# Altium schematic sheet MAIN.schdoc
size 299 x 217 mm
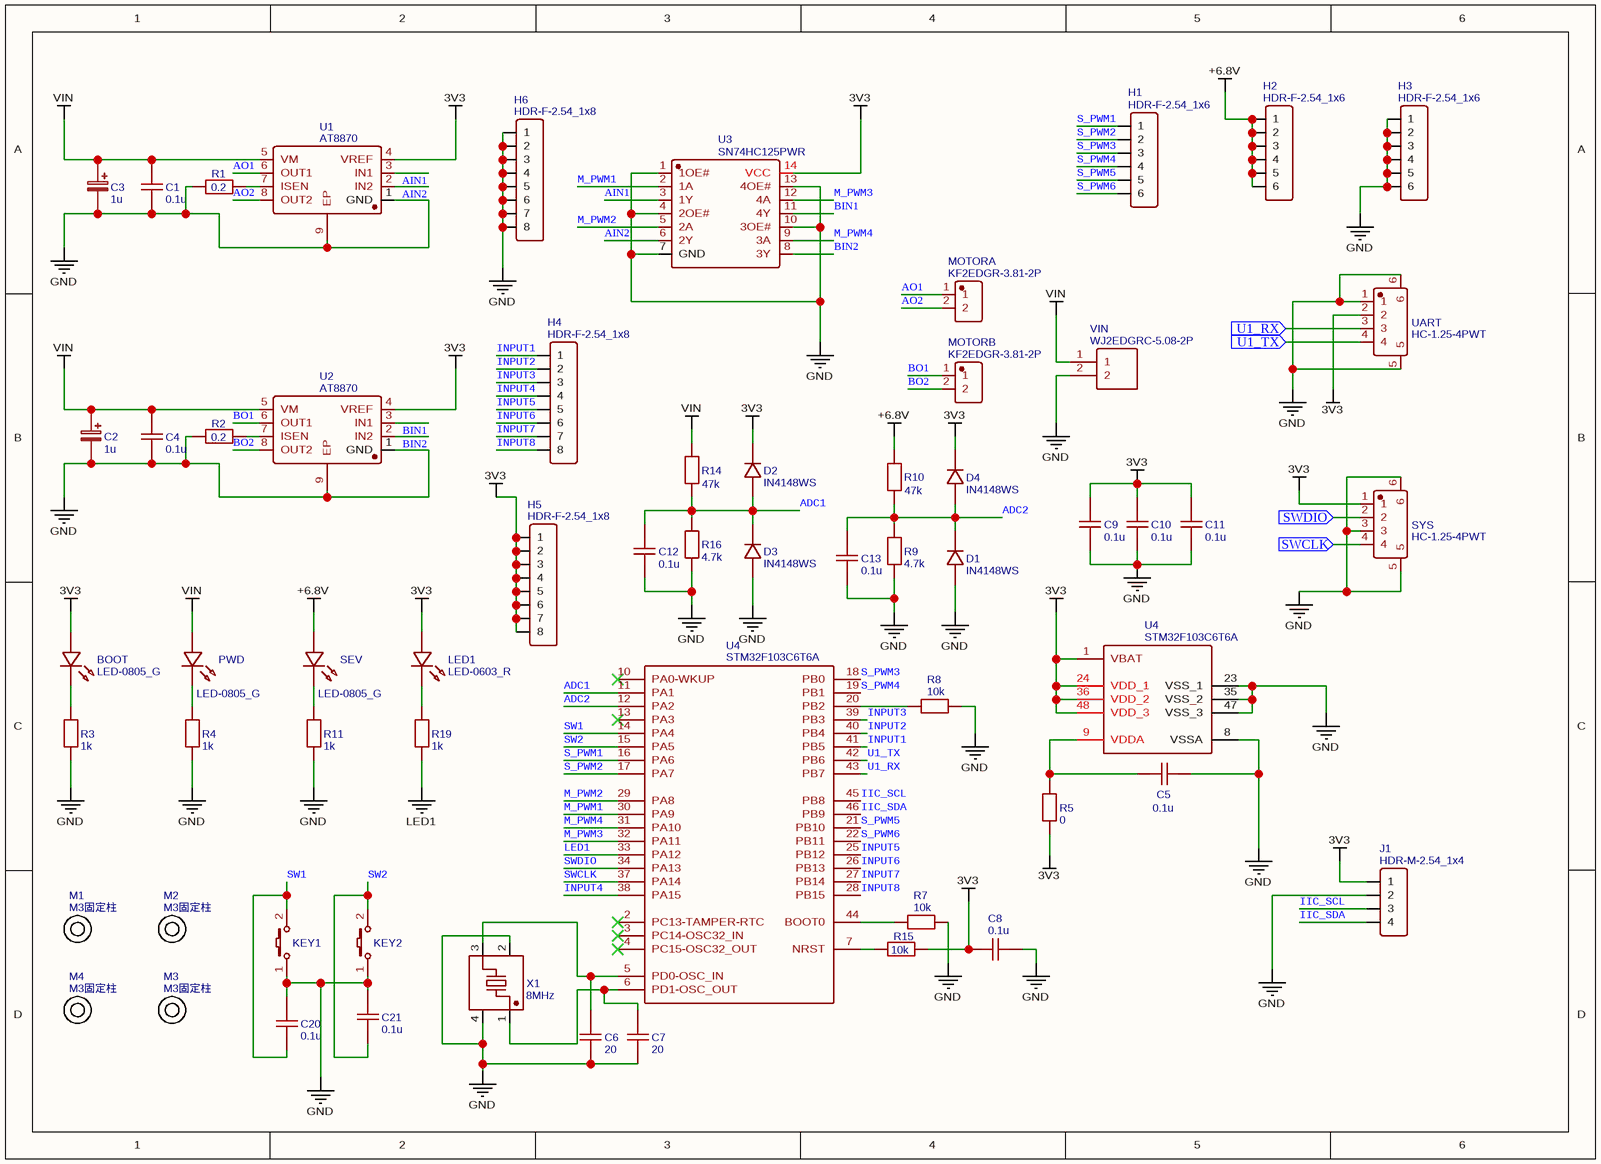
[diagram p0: MAIN.schdoc]

## Parts
(Parts that share a designator on the sheet are numbered #1, #2 ... from top to bottom, then left to right.)
BOOT  LED-0805_G  [LED0805_GREEN]
C1  0.1u  [C0603]
C2  1u  [CAP-D6.3×H5.5]
C3  1u  [CAP-D6.3×H5.5]
C4  0.1u  [C0603]
C5  0.1u  [C0603]
C6  20  [C0603]
C7  20  [C0603]
C8  0.1u  [C0603]
C9  0.1u  [C0603]
C10  0.1u  [C0603]
C11  0.1u  [C0603]
C12  0.1u  [C0603]
C13  0.1u  [C0603]
C20  0.1u  [C0603]
C21  0.1u  [C0603]
D1  IN4148WS  [SOD-323_L1.8-W1.3-LS2.5-RD]
D2  IN4148WS  [SOD-323_L1.8-W1.3-LS2.5-RD]
D3  IN4148WS  [SOD-323_L1.8-W1.3-LS2.5-RD]
D4  IN4148WS  [SOD-323_L1.8-W1.3-LS2.5-RD]
H1  HDR-F-2.54_1x6  [HDR-F-2.54_1X6]
H2  HDR-F-2.54_1x6  [HDR-F-2.54_1X6]
H3  HDR-F-2.54_1x6  [HDR-F-2.54_1X6]
H4  HDR-F-2.54_1x8  [HDR-F-2.54_1X8]
H5  HDR-F-2.54_1x8  [HDR-F-2.54_1X8]
H6  HDR-F-2.54_1x8  [HDR-F-2.54_1X8]
J1  HDR-M-2.54_1x4  [HDR-M-2.54_1X4]
KEY1  K2-3.6×6.1_SMD  [KEY-SMD_2P-L6.2-W3.6-LS8.0]  (value not drawn)
KEY2  K2-3.6×6.1_SMD  [KEY-SMD_2P-L6.2-W3.6-LS8.0]  (value not drawn)
LED1  LED-0603_R  [LED0603_RED]
M1  M3固定柱  [M3螺丝孔外直径6MM-带8小孔]
M2  M3固定柱  [M3螺丝孔外直径6MM-带8小孔]
M3  M3固定柱  [M3螺丝孔外直径6MM-带8小孔]
M4  M3固定柱  [M3螺丝孔外直径6MM-带8小孔]
MOTORA  KF2EDGR-3.81-2P  [CONN-TH_2P-P3.81_KF2EDGR-3.81-2P]
MOTORB  KF2EDGR-3.81-2P  [CONN-TH_2P-P3.81_KF2EDGR-3.81-2P]
PWD  LED-0805_G  [LED0805_GREEN]
R1  0.2  [R0603]
R2  0.2  [R0603]
R3  1k  [R0603]
R4  1k  [R0603]
R5  0  [R0603]
R7  10k  [R0603]
R8  10k  [R0603]
R9  4.7k  [R0603]
R10  47k  [R0603]
R11  1k  [R0603]
R14  47k  [R0603]
R15  10k  [R0603]
R16  4.7k  [R0603]
R19  1k  [R0603]
SEV  LED-0805_G  [LED0805_GREEN]
SYS  HC-1.25-4PWT  [CONN-SMD_4P-P1.25-HC-1.25-4PWT]
U1  AT8870  [SOP-8_L4.9-W3.9-P1.27-LS6.0-BL-EP]
U2  AT8870  [SOP-8_L4.9-W3.9-P1.27-LS6.0-BL-EP]
U3  SN74HC125PWR  [TSSOP-14_L5.0-W4.4-P0.65-LS6.5-BL]
U4#1  STM32F103C6T6A  [LQFP-48_L7.0-W7.0-P0.50-LS9.0-BL]
U4#2  STM32F103C6T6A  [LQFP-48_L7.0-W7.0-P0.50-LS9.0-BL]
UART  HC-1.25-4PWT  [CONN-SMD_4P-P1.25-HC-1.25-4PWT]
VIN  WJ2EDGRC-5.08-2P  [CONN-TH_2P-P5.08_WJ2EDGRC-5.08-2P]
X1  8MHz  [CRYSTAL-SMD_4P-L3.2-W2.5-BL]

## Ports
SWCLK (in), SWDIO (in), U1_RX (in), U1_TX (in)

## Nets
3V3: BOOT.1 C8.1 C9.2 C10.2 C11.2 D2.1(C) D4.1(C) H5.1 H5.2 H5.3 H5.4 H5.5 H5.6 H5.7 H5.8 J1.1 LED1.1 R5.1 R15.2 SYS.1 U1.4(VREF) U2.4(VREF) U3.14(VCC) U4#1.1(VBAT) U4#1.24(VDD_1) U4#1.36(VDD_2) U4#1.48(VDD_3) UART.2
+6.8V: H2.1 H2.2 H2.3 H2.4 H2.5 H2.6 R10.2 SEV.1
GND: C1.1 C2.2 C3.2 C4.1 C5.2 C6.1 C7.1 C8.2 C9.1 C10.1 C11.1 C12.1 C13.1 C20.2 C21.2 D1.2(A) D3.2(A) H3.1 H3.2 H3.3 H3.4 H3.5 H3.6 H6.1 H6.2 H6.3 H6.4 H6.5 H6.6 H6.7 H6.8 J1.2 KEY1.1 KEY2.1 R1.2 R2.2 R3.1 R4.1 R7.2 R8.2 R9.1 R11.1 R16.1 SYS.3 SYS.5 SYS.6 U1.1(GND) U1.9(EP) U2.1(GND) U2.9(EP) U3.1(1OE#) U3.4(2OE#) U3.7(GND) U3.10(3OE#) U3.13(4OE#) U4#1.8(VSSA) U4#1.23(VSS_1) U4#1.35(VSS_2) U4#1.47(VSS_3) UART.1 UART.5 UART.6 VIN.2 X1.2(GND) X1.4(GND)
LED1: R19.1 U4#2.33(PA12)
VIN: C1.2 C2.1 C3.1 C4.2 PWD.1 R14.2 U1.5(VM) U2.5(VM) VIN.1
ADC1: C12.2 D2.2(A) D3.1(C) R14.1 R16.2 U4#2.11(PA1)
ADC2: C13.2 D1.1(C) D4.2(A) R9.2 R10.1 U4#2.12(PA2)
AIN1: U1.3(IN1) U3.3(1Y)
AIN2: U1.2(IN2) U3.6(2Y)
AO1: MOTORA.1 U1.6(OUT1)
AO2: MOTORA.2 U1.8(OUT2)
BIN1: U2.3(IN1) U3.11(4Y)
BIN2: U2.2(IN2) U3.8(3Y)
BO1: MOTORB.1 U2.6(OUT1)
BO2: MOTORB.2 U2.8(OUT2)
IIC_SCL: J1.3 U4#2.45(PB8)
IIC_SDA: J1.4 U4#2.46(PB9)
INPUT1: H4.1 U4#2.41(PB5)
INPUT2: H4.2 U4#2.40(PB4)
INPUT3: H4.3 U4#2.39(PB3)
INPUT4: H4.4 U4#2.38(PA15)
INPUT5: H4.5 U4#2.25(PB12)
INPUT6: H4.6 U4#2.26(PB13)
INPUT7: H4.7 U4#2.27(PB14)
INPUT8: H4.8 U4#2.28(PB15)
M_PWM1: U3.2(1A) U4#2.30(PA9)
M_PWM2: U3.5(2A) U4#2.29(PA8)
M_PWM3: U3.12(4A) U4#2.32(PA11)
M_PWM4: U3.9(3A) U4#2.31(PA10)
S_PWM1: H1.1 U4#2.16(PA6)
S_PWM2: H1.2 U4#2.17(PA7)
S_PWM3: H1.3 U4#2.18(PB0)
S_PWM4: H1.4 U4#2.19(PB1)
S_PWM5: H1.5 U4#2.21(PB10)
S_PWM6: H1.6 U4#2.22(PB11)
SW1: C20.1 KEY1.2 U4#2.14(PA4)
SW2: C21.1 KEY2.2 U4#2.15(PA5)
SWCLK: U4#2.37(PA14)
SWCLK: SYS.4 ; port SWCLK  [a separate net that carries the same name]
SWDIO: U4#2.34(PA13)
SWDIO: SYS.2 ; port SWDIO  [a separate net that carries the same name]
U1_RX: U4#2.43(PB7)
U1_RX: UART.3 ; port U1_RX  [a separate net that carries the same name]
U1_TX: U4#2.42(PB6)
U1_TX: UART.4 ; port U1_TX  [a separate net that carries the same name]
NetBOOT_2: BOOT.2 R3.2
NetC5_1: C5.1 R5.2 U4#1.9(VDDA)
NetC6_2: C6.2 U4#2.5(PD0-OSC_IN) X1.3
NetC7_2: C7.2 U4#2.6(PD1-OSC_OUT) X1.1
NetLED1_2: LED1.2 R19.2
NetPWD_2: PWD.2 R4.2
NetR1_1: R1.1 U1.7(ISEN)
NetR2_1: R2.1 U2.7(ISEN)
NetR7_1: R7.1 U4#2.44(BOOT0)
NetR8_1: R8.1 U4#2.20(PB2)
NetR11_2: R11.2 SEV.2
NetR15_1: R15.1 U4#2.7(NRST)

Not connected (* = marked no-connect by the designer): U4#2 2(PC13-TAMPER-RTC)* 3(PC14-OSC32_IN)* 4(PC15-OSC32_OUT)* 10(PA0-WKUP)* 13(PA3)*

## Library data of the parts
BOOT PWD SEV = LED-0805_G: BOM_Manufacturer: 国星光电; BOM_Manufacturer Part: NCD0805G1; Contributor: LCEDA_Lib; BOM_Supplier Part: C84260; spicePre: L; spiceSymbolName: LED-0805_G
C1 C4 C5 C8-C13 C20 C21 = 0.1u: nameAlias: Value(F); Contributor: LCEDA_Lib; spicePre: C; spiceSymbolName: C_0603_US
C2 C3 = 1u: nameAlias: Value(F); Contributor: LCEDA_Lib; spicePre: C; spiceSymbolName: CE_SMD_D6.3×H5.5_EU
C6 C7 = 20: nameAlias: Value(F); Contributor: LCEDA_Lib; spicePre: C; spiceSymbolName: C_0603_US
D1-D4 = IN4148WS: BOM_Manufacturer: Leshan Radio; Contributor: LCSC; BOM_Supplier: LCSC; BOM_Supplier Part: C417545; BOM_Manufacturer Part: IN4148WS; BOM_JLCPCB Part Class: Extended Part; spicePre: D; spiceSymbolName: IN4148WS
H1-H3 = HDR-F-2.54_1x6: Contributor: LCEDA_Lib; BOM_Supplier Part: C40877; BOM_Supplier: LCSC; spicePre: H; spiceSymbolName: HDR-F-2.54_1x6
H4-H6 = HDR-F-2.54_1x8: Contributor: LCEDA_Lib; BOM_Supplier Part: C225505; BOM_Supplier: LCSC; spicePre: H; spiceSymbolName: HDR-F-2.54_1x8
J1 = HDR-M-2.54_1x4: Contributor: LCEDA_Lib; BOM_Supplier Part: C124378; BOM_Supplier: LCSC; spicePre: J; spiceSymbolName: HDR-M-2.54_1x4
KEY1 KEY2 = K2-3.6×6.1_SMD: BOM_Manufacturer Part: K2-1107ST-A4SW-06; Contributor: LCEDA_Lib; 制造商: 韩国韩荣; BOM_Supplier Part: C118141; BOM_Supplier: LCSC; spicePre: K; spiceSymbolName: K2-3.6×6.1_SMD
LED1 = LED-0603_R: BOM_Manufacturer: EVERLIGHT(台湾亿光); BOM_Manufacturer Part: 19-217/R6C-AL1M2VY/3T; Contributor: LCEDA_01; BOM_Supplier Part: C72044; BOM_Supplier: LCSC; spicePre: L; spiceSymbolName: LED-0603_R
M1-M4 = M3固定柱: Contributor: duyes; spicePre: M; spiceSymbolName: M3固定柱
MOTORA MOTORB = KF2EDGR-3.81-2P: BOM_Manufacturer: Cixi Kefa Elec; Contributor: LCSC; BOM_Supplier: LCSC; BOM_Supplier Part: C441182; BOM_Manufacturer Part: KF2EDGR-3.81-2P; BOM_JLCPCB Part Class: Extended Part; spicePre: C; spiceSymbolName: KF2EDGR-3.81-2P
R1 R2 = 0.2: nameAlias: Value(Ω); Contributor: LCEDA_Lib; spicePre: R; spiceSymbolName: R_0603_EU
R3 R4 R11 R19 = 1k: nameAlias: Value(Ω); Contributor: LCEDA_Lib; spicePre: R; spiceSymbolName: R_0603_EU
R5 = 0: nameAlias: Value(Ω); Contributor: LCEDA_Lib; spicePre: R; spiceSymbolName: R_0603_EU
R7 R8 R15 = 10k: nameAlias: Value(Ω); Contributor: LCEDA_Lib; spicePre: R; spiceSymbolName: R_0603_EU
R9 R16 = 4.7k: nameAlias: Value(Ω); Contributor: LCEDA_Lib; spicePre: R; spiceSymbolName: R_0603_EU
R10 R14 = 47k: nameAlias: Value(Ω); Contributor: LCEDA_Lib; spicePre: R; spiceSymbolName: R_0603_EU
SYS UART = HC-1.25-4PWT: BOM_Manufacturer: HCTL(华灿天禄); Contributor: LCSC; BOM_Supplier: LCSC; BOM_Supplier Part: C2845381; BOM_Manufacturer Part: HC-1.25-4PWT; BOM_JLCPCB Part Class: Extended Part; spicePre: C; spiceSymbolName: HC-1.25-4PWT
U1 U2 = AT8870: BOM_Manufacturer: Jiaxing Heroic Elec Tech; Contributor: LCSC; BOM_Supplier: LCSC; BOM_Supplier Part: C191458; BOM_Manufacturer Part: AT8870; BOM_JLCPCB Part Class: Extended Part; spicePre: U; spiceSymbolName: AT8870
U3 = SN74HC125PWR: BOM_Manufacturer: Texas Instruments; Contributor: LCSC; BOM_Supplier: LCSC; BOM_Supplier Part: C132994; BOM_Manufacturer Part: SN74HC125PWR; BOM_JLCPCB Part Class: Extended Part; spicePre: U; spiceSymbolName: SN74HC125PWR
U4#1 U4#2 = STM32F103C6T6A: BOM_Manufacturer: ST; subpart_no: 1; tags: STM32; BOM_Supplier Part: C8303; BOM_Supplier: LCSC; BOM_Manufacturer Part: STM32F103C6T6A; BOM_JLCPCB Part Class: Extended Part; spicePre: U; spiceSymbolName: STM32F103C6T6A
VIN = WJ2EDGRC-5.08-2P: BOM_Manufacturer: ReliaPro; BOM_Supplier: LCSC; BOM_Manufacturer Part: WJ2EDGRC-5.08-2P; BOM_Supplier Part: C3697; BOM_JLCPCB Part Class: Extended Part; spicePre: C; spiceSymbolName: WJ2EDGRC-5.08-2P
X1 = 8MHz: BOM_Manufacturer: YXC扬兴科技; BOM_Manufacturer Part: X32258MSB4SI; nameAlias: Frequency; Contributor: LCSC; BOM_Supplier: LCSC; BOM_Supplier Part: C2682774; BOM_JLCPCB Part Class: Extended Part; spicePre: X; spiceSymbolName: X32258MSB4SI